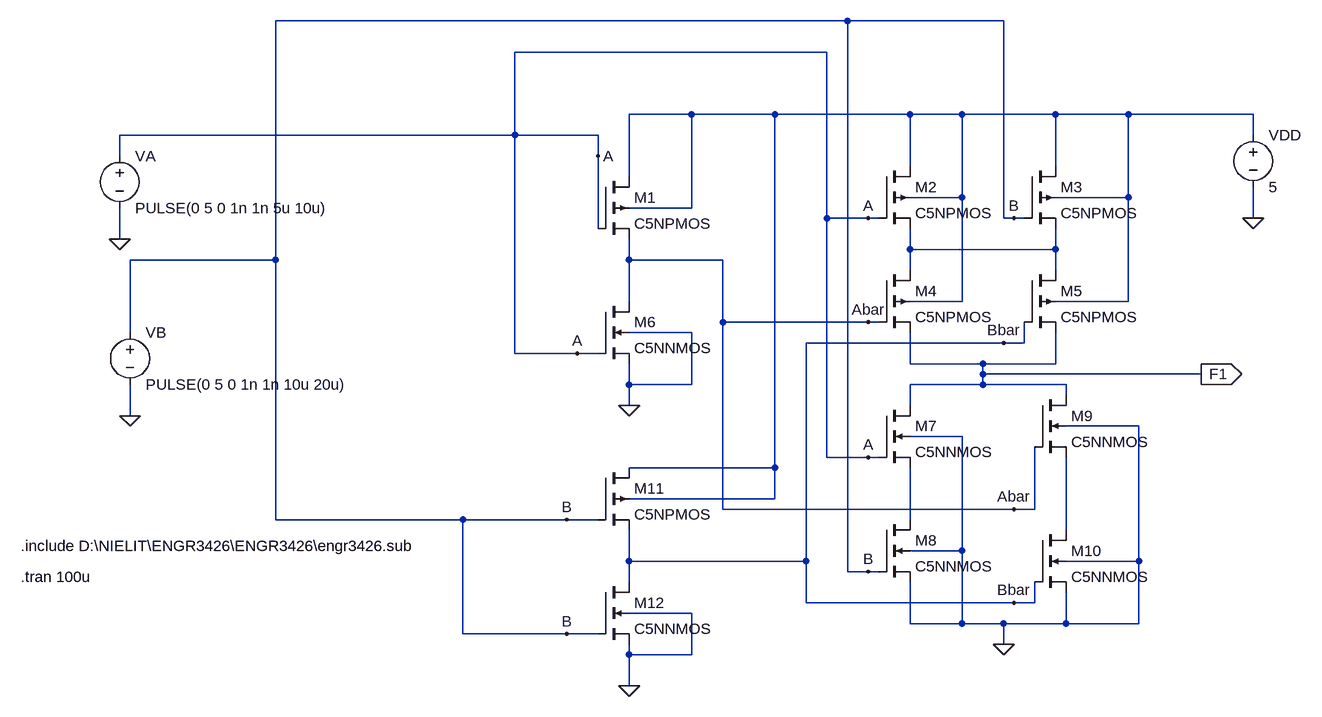
[diagram p0: schematic F1.asc]
F1.asc, the LTspice schematic file:
Version 4
SHEET 1 1260 900
WIRE 304 -288 -576 -288
WIRE 544 -288 304 -288
WIRE 272 -240 -208 -240
WIRE 64 -144 -32 -144
WIRE 192 -144 64 -144
WIRE 400 -144 192 -144
WIRE 480 -144 400 -144
WIRE 624 -144 480 -144
WIRE 736 -144 624 -144
WIRE 928 -144 736 -144
WIRE -208 -112 -208 -240
WIRE -208 -112 -816 -112
WIRE -80 -112 -208 -112
WIRE 928 -112 928 -144
WIRE -816 -80 -816 -112
WIRE -80 -80 -80 -112
WIRE 400 -64 400 -144
WIRE 624 -64 624 -144
WIRE -32 -48 -32 -144
WIRE 480 -16 480 -144
WIRE 480 -16 400 -16
WIRE 736 -16 736 -144
WIRE 736 -16 624 -16
WIRE 64 0 64 -144
WIRE 64 0 -32 0
WIRE 272 16 272 -240
WIRE 336 16 272 16
WIRE 352 16 336 16
WIRE 544 16 544 -288
WIRE 560 16 544 16
WIRE 576 16 560 16
WIRE 928 16 928 -32
WIRE -80 32 -80 -80
WIRE -816 48 -816 0
WIRE 400 64 400 32
WIRE 624 64 624 32
WIRE 624 64 400 64
WIRE -576 80 -576 -288
WIRE -576 80 -800 80
WIRE -32 80 -32 48
WIRE 112 80 -32 80
WIRE 400 96 400 64
WIRE 624 96 624 64
WIRE -32 144 -32 80
WIRE 480 144 480 -16
WIRE 480 144 400 144
WIRE 736 144 736 -16
WIRE 736 144 624 144
WIRE 112 176 112 80
WIRE 336 176 112 176
WIRE 352 176 336 176
WIRE -800 192 -800 80
WIRE 64 192 -32 192
WIRE 544 208 240 208
WIRE 576 208 576 176
WIRE 576 208 544 208
WIRE -208 224 -208 -112
WIRE -112 224 -208 224
WIRE -80 224 -112 224
WIRE 400 240 400 192
WIRE 512 240 400 240
WIRE 624 240 624 192
WIRE 624 240 512 240
WIRE 512 256 512 240
WIRE 848 256 512 256
WIRE -32 272 -32 240
WIRE 64 272 64 192
WIRE 64 272 -32 272
WIRE 512 272 512 256
WIRE 512 272 400 272
WIRE 640 272 512 272
WIRE 640 288 640 272
WIRE -32 304 -32 272
WIRE 400 304 400 272
WIRE -800 320 -800 272
WIRE 752 336 640 336
WIRE 480 352 400 352
WIRE 272 384 272 16
WIRE 336 384 272 384
WIRE 352 384 336 384
WIRE 192 400 192 -144
WIRE 192 400 -32 400
WIRE 192 448 192 400
WIRE 192 448 -32 448
WIRE 112 464 112 176
WIRE 560 464 112 464
WIRE 592 464 592 368
WIRE 592 464 560 464
WIRE -576 480 -576 80
WIRE -288 480 -576 480
WIRE -128 480 -288 480
WIRE -80 480 -128 480
WIRE 400 480 400 400
WIRE 640 496 640 384
WIRE 480 528 480 352
WIRE 480 528 400 528
WIRE -32 544 -32 496
WIRE 240 544 240 208
WIRE 240 544 -32 544
WIRE 752 544 752 336
WIRE 752 544 640 544
WIRE 304 560 304 -288
WIRE 336 560 304 560
WIRE 352 560 336 560
WIRE -32 576 -32 544
WIRE 240 608 240 544
WIRE 560 608 240 608
WIRE 592 608 592 576
WIRE 592 608 560 608
WIRE 64 624 -32 624
WIRE 400 640 400 576
WIRE 480 640 480 528
WIRE 480 640 400 640
WIRE 544 640 480 640
WIRE 640 640 640 592
WIRE 640 640 544 640
WIRE 752 640 752 544
WIRE 752 640 640 640
WIRE -288 656 -288 480
WIRE -128 656 -288 656
WIRE -80 656 -128 656
WIRE 544 672 544 640
WIRE -32 688 -32 672
WIRE 64 688 64 624
WIRE 64 688 -32 688
WIRE -32 736 -32 688
FLAG 544 672 0
FLAG -32 304 0
FLAG 928 16 0
FLAG -32 736 0
FLAG -816 48 0
FLAG -800 320 0
FLAG 848 256 F1
IOPIN 848 256 Out
FLAG -80 -80 A
FLAG -112 224 A
FLAG -128 480 B
FLAG -128 656 B
FLAG 336 16 A
FLAG 336 176 Abar
FLAG 336 384 A
FLAG 336 560 B
FLAG 560 464 Abar
FLAG 544 208 Bbar
FLAG 560 16 B
FLAG 560 608 Bbar
SYMBOL pmos4 -80 -48 R0
SYMATTR InstName M1
SYMATTR Value C5NPMOS
SYMATTR Value2 l=0.6u w=7.2u
SYMBOL pmos4 352 -64 R0
SYMATTR InstName M2
SYMATTR Value C5NPMOS
SYMATTR Value2 l=0.6u w=7.2u
SYMBOL pmos4 576 -64 R0
SYMATTR InstName M3
SYMATTR Value C5NPMOS
SYMATTR Value2 l=0.6u w=7.2u
SYMBOL pmos4 352 96 R0
SYMATTR InstName M4
SYMATTR Value C5NPMOS
SYMATTR Value2 l=0.6u w=7.2u
SYMBOL pmos4 576 96 R0
SYMATTR InstName M5
SYMATTR Value C5NPMOS
SYMATTR Value2 l=0.6u w=7.2u
SYMBOL nmos4 352 304 R0
SYMATTR InstName M7
SYMATTR Value C5NNMOS
SYMATTR Value2 l=0.6u w=3.6u
SYMBOL nmos4 352 480 R0
SYMATTR InstName M8
SYMATTR Value C5NNMOS
SYMATTR Value2 l=0.6u w=3.6u
SYMBOL nmos4 592 288 R0
SYMATTR InstName M9
SYMATTR Value C5NNMOS
SYMATTR Value2 l=0.6u w=3.6u
SYMBOL nmos4 592 496 R0
SYMATTR InstName M10
SYMATTR Value C5NNMOS
SYMATTR Value2 l=0.6u w=3.6u
SYMBOL voltage 928 -128 R0
SYMATTR InstName VDD
SYMATTR Value 5
SYMBOL pmos4 -80 400 R0
SYMATTR InstName M11
SYMATTR Value C5NPMOS
SYMATTR Value2 l=0.6u w=7.2u
SYMBOL nmos4 -80 576 R0
SYMATTR InstName M12
SYMATTR Value C5NNMOS
SYMATTR Value2 l=0.6u w=3.6u
SYMBOL nmos4 -80 144 R0
SYMATTR InstName M6
SYMATTR Value C5NNMOS
SYMATTR Value2 l=0.6u w=3.6u
SYMBOL voltage -816 -96 R0
WINDOW 123 0 0 Left 0
WINDOW 39 0 0 Left 0
SYMATTR InstName VA
SYMATTR Value PULSE(0 5 0 1n 1n 5u 10u)
SYMBOL voltage -800 176 R0
WINDOW 123 0 0 Left 0
WINDOW 39 0 0 Left 0
SYMATTR InstName VB
SYMATTR Value PULSE(0 5 0 1n 1n 10u 20u)
TEXT -968 568 Left 2 !.tran 100u
TEXT -968 520 Left 2 !.include D:\\NIELIT\\ENGR3426\\ENGR3426\\engr3426.sub

The netlist it stands for:
* F1.asc
M1 N001 A Abar N001 C5NPMOS l=0.6u w=7.2u
M2 N001 A N002 N001 C5NPMOS l=0.6u w=7.2u
M3 N001 B N002 N001 C5NPMOS l=0.6u w=7.2u
M4 N002 Abar F1 N001 C5NPMOS l=0.6u w=7.2u
M5 N002 Bbar F1 N001 C5NPMOS l=0.6u w=7.2u
M7 F1 A N003 0 C5NNMOS l=0.6u w=3.6u
M8 N003 B 0 0 C5NNMOS l=0.6u w=3.6u
M9 F1 Abar N004 0 C5NNMOS l=0.6u w=3.6u
M10 N004 Bbar 0 0 C5NNMOS l=0.6u w=3.6u
VDD N001 0 5
M11 N001 B Bbar N001 C5NPMOS l=0.6u w=7.2u
M12 Bbar B 0 0 C5NNMOS l=0.6u w=3.6u
M6 Abar A 0 0 C5NNMOS l=0.6u w=3.6u
VA A 0 PULSE(0 5 0 1n 1n 5u 10u)
VB B 0 PULSE(0 5 0 1n 1n 10u 20u)
.model NMOS NMOS
.model PMOS PMOS
.lib standard.mos
.tran 100u
.include D:\NIELIT\ENGR3426\ENGR3426\engr3426.sub
.backanno
.end